# EAGLE design Smartwatch-EXTRA-BOTTOM (EAGLE 9.6.2)
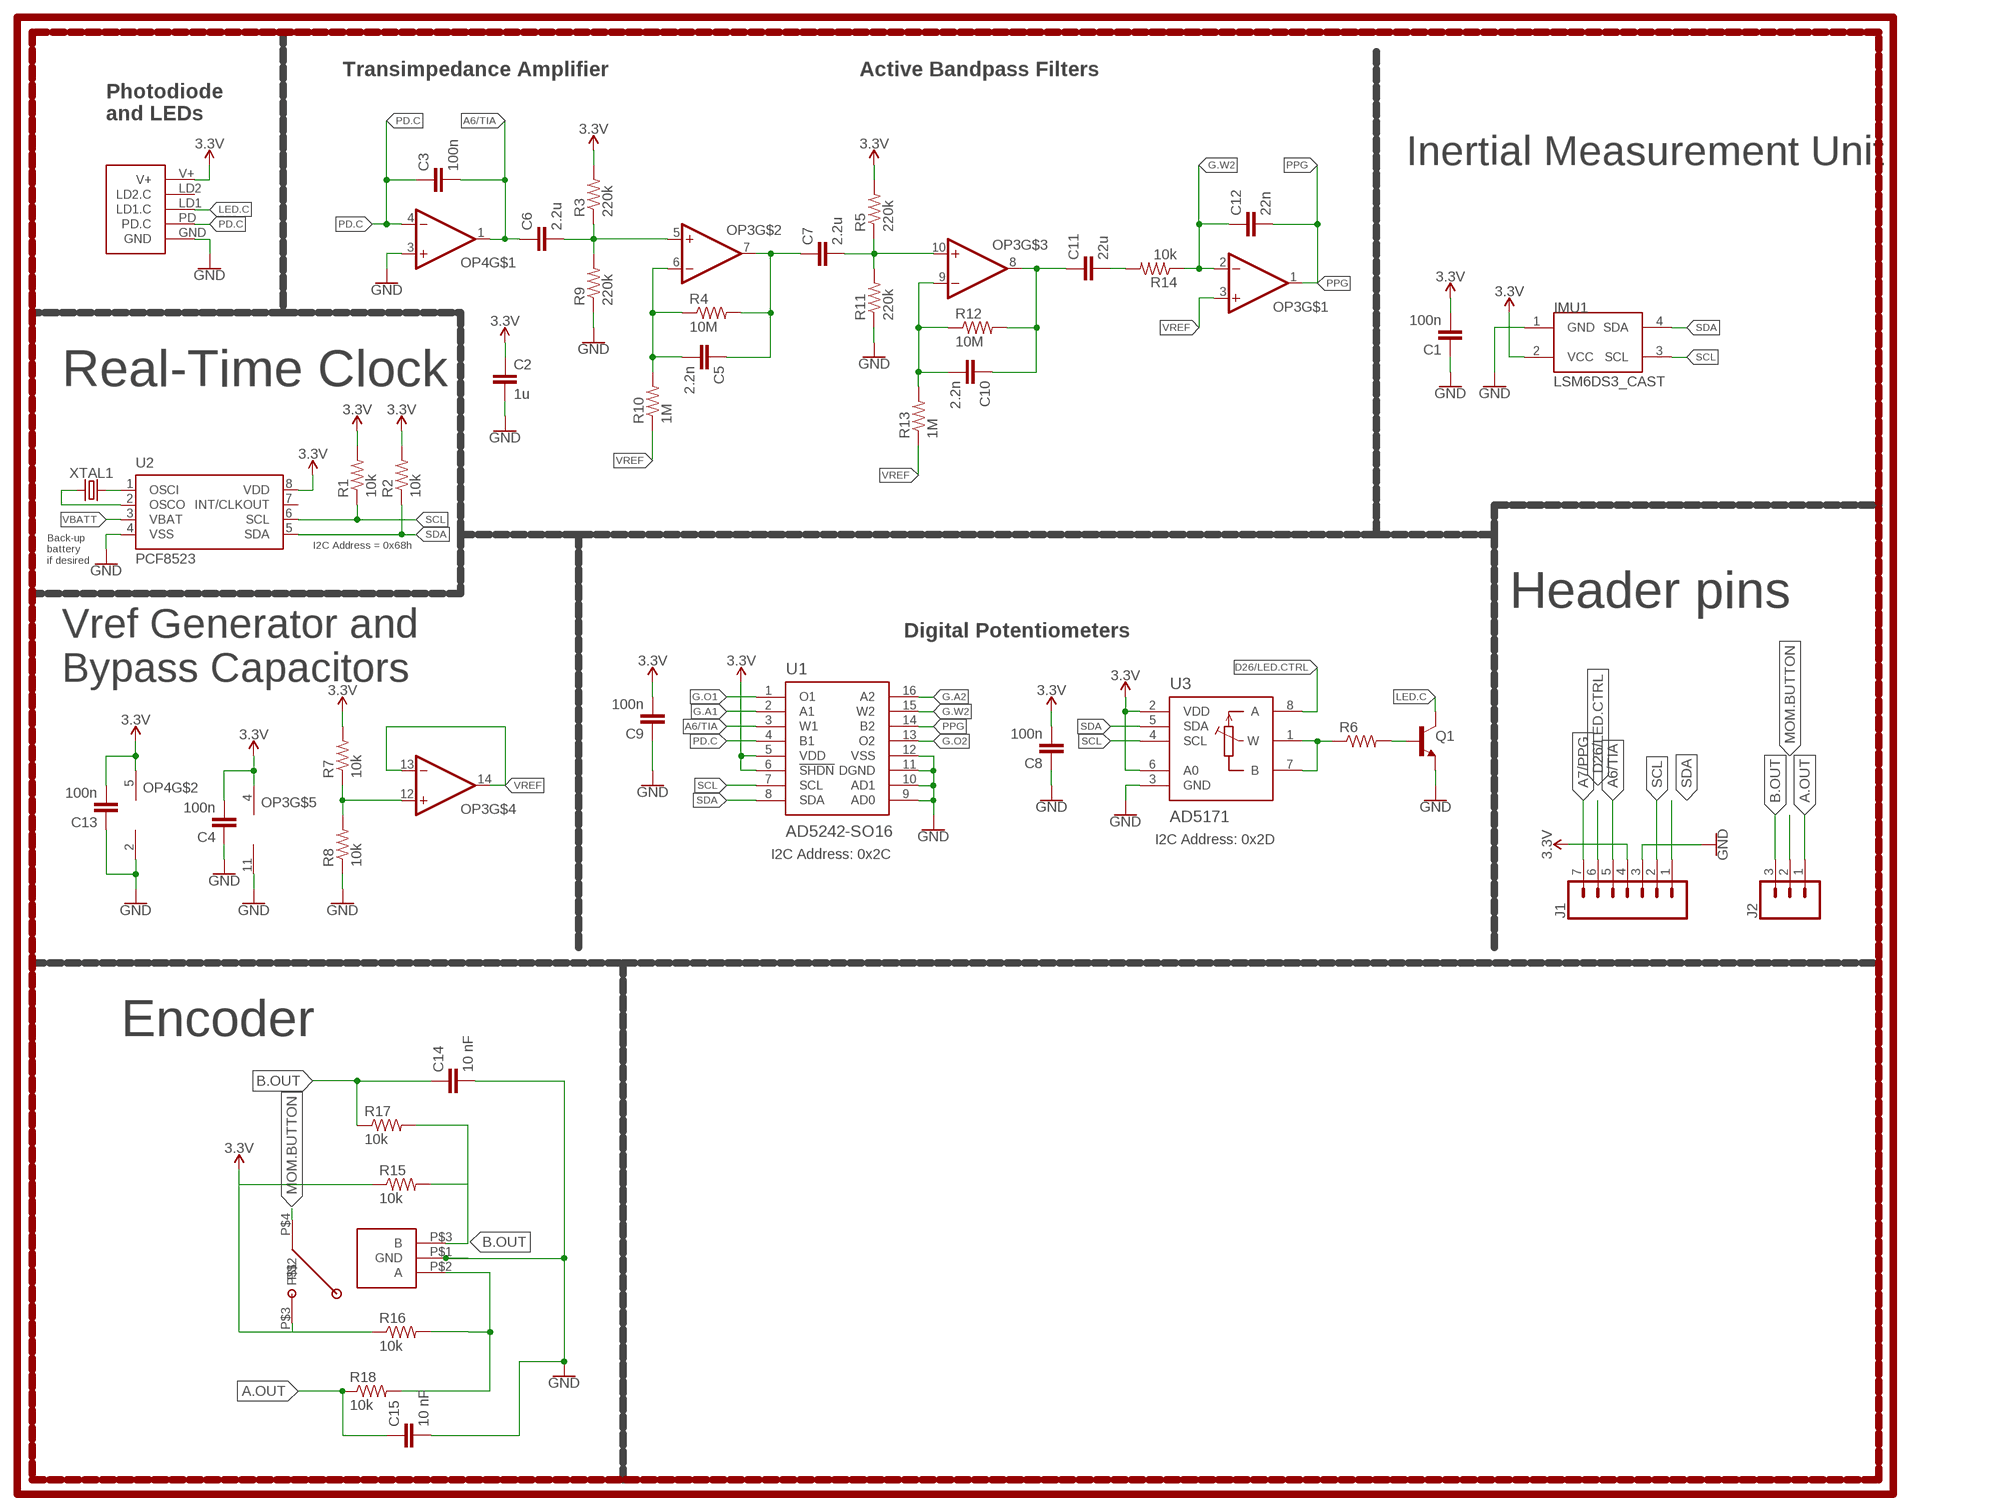
[diagram p0: schematic, sheet 1]

## Parts
B1  SWITCH  [SWITCH]
C1  100n  CAPACITOR0603  [C0603]
C2  1u  CAPACITOR0603  [C0603]
C3  100n  CAPACITOR0603  [C0603]
C4  100n  CAPACITOR0603  [C0603]
C5  2.2n  CAPACITOR0603  [C0603]
C6  2.2u  CAPACITOR0603  [C0603]
C7  2.2u  CAPACITOR0603  [C0603]
C8  100n  CAPACITOR0603  [C0603]
C9  100n  CAPACITOR0603  [C0603]
C10  2.2n  CAPACITOR0603  [C0603]
C11  22u  CAPACITOR0603  [C0603]
C12  22n  CAPACITOR0603  [C0603]
C13  100n  CAPACITOR0603  [C0603]
C14  10 nF  CAPACITOR0603  [C0603]
C15  10 nF  CAPACITOR0603  [C0603]
ENC1  EVQVU  [EVQVU]
IMU1  LSM6DS3_CAST  [LSM6DS3_CAST]
J1  CONN_07-1.27MM  [1X07_1.27MM]
J2  CONN_03.50MIL  [1X03_1.27MM]
OP3  OP-QUAD-SO14  [SO14]
OP4  OP-SINGLEOT  [SOT23-5]
Q1  NPN-GENERIC  [SOT23-3]
R1  10k  RESISTOR0603  [R0603]
R2  10k  RESISTOR0603  [R0603]
R3  220k  RESISTOR0603  [R0603]
R4  10M  RESISTOR0603  [R0603]
R5  220k  RESISTOR0603  [R0603]
R6  RESISTOR0603  [R0603]
R7  10k  RESISTOR0402  [R0402]
R8  10k  RESISTOR0402  [R0402]
R9  220k  RESISTOR0603  [R0603]
R10  1M  RESISTOR0603  [R0603]
R11  220k  RESISTOR0603  [R0603]
R12  10M  RESISTOR0603  [R0603]
R13  1M  RESISTOR0603  [R0603]
R14  10k  RESISTOR0603  [R0603]
R15  10k  RESISTOR0603  [R0603]
R16  10k  RESISTOR0603  [R0603]
R17  10k  RESISTOR0603  [R0603]
R18  10k  RESISTOR0603  [R0603]
U1  AD5242-SO16  [SO16]
U2  PCF8523  [SO8]
U3  AD5171  [SOT-23-8]
U4  PPG.MODULE.2  [PPG.MODULE.2]
XTAL1  32.7680kHz  CRYSTALECS-.327-12.5-12-C-TR  [2-SMD.NOLEAD.2.0MMTO1.2MM]

## Nets
3.3V: B1.P$3 C1.2 C2.1 C4.2 C8.2 C9.2 C13.2 IMU1.2(VCC) J1.4 OP3.4(V+) OP4.5(V+) R1.2 R2.2 R3.2 R5.2 R7.2 R15.1 R16.1 U1.5(VDD) U1.6(!SHDN) U2.8(VDD) U3.2(VDD) U3.6(A0) U4.V+
A6/TIA: C3.2 C6.1 J1.5 OP4.1(OUT) U1.3(W1)
A7/PPG: J1.7
A.OUT: C15.1 ENC1.P$2(A) J2.1 R16.2 R18.1 R18.2
B.OUT: C14.1 ENC1.P$3(B) J2.3 R17.1
D26/LED.CTRL: J1.6 U3.8(A)
G.A1: U1.2(A1)
G.A2: U1.16(A2)
G.O1: U1.1(O1)
G.O2: U1.13(O2)
G.W2: C12.1 OP3.2(-IN) R14.1 U1.15(W2)
GND: C1.1 C2.2 C4.1 C8.1 C9.1 C13.1 C14.2 C15.2 ENC1.P$1(GND) IMU1.1(GND) J1.3 OP3.11(V-) OP4.2(V-) OP4.3(+IN) Q1.2(E) R8.1 R9.1 R11.1 U1.9(AD0) U1.10(AD1) U1.11(DGND) U1.12(VSS) U2.4(VSS) U3.3(GND) U4.GND
LED.C: Q1.3(C) U4.LD1(LD1.C)
MOM.BUTTON: B1.P$4 J2.2
N$2: U2.2(OSCO) XTAL1.P$1
N$3: U2.1(OSCI) XTAL1.P$2
N$4: R15.2 R17.2
N$8: Q1.1(B) R6.2
N$9: R6.1 U3.1(W) U3.7(B)
N$10: OP3.12(+IN) R7.1 R8.2
N$13: C6.2 OP3.5(+IN) R3.1 R9.2
N$15: C5.2 OP3.6(-IN) R4.1 R10.2
N$16: C5.1 C7.1 OP3.7(OUT) R4.2
N$17: C7.2 OP3.10(+IN) R5.1 R11.2
N$18: C10.2 OP3.9(-IN) R12.1 R13.2
N$19: C10.1 C11.1 OP3.8(OUT) R12.2
N$20: C11.2 R14.2
PD.C: C3.1 OP4.4(-IN) U1.4(B1) U4.PD(PD.C)
PPG: C12.2 OP3.1(OUT) U1.14(B2)
SCL: IMU1.3(SCL) J1.2 R1.1 U1.7(SCL) U2.6(SCL) U3.4(SCL)
SDA: IMU1.4(SDA) J1.1 R2.1 U1.8(SDA) U2.5(SDA) U3.5(SDA)
VBATT: U2.3(VBAT)
VREF: OP3.3(+IN) OP3.13(-IN) OP3.14(OUT) R10.1 R13.1
Unconnected: U2.7(INT/CLKOUT) U4.LD2(LD2.C)

## Notes on the sheet
- Transimpedance Amplifier | Active Bandpass Filters
- Photodiode
  and LEDs
- Inertial Measurement Unit
- Real-Time Clock
- I2C Address = 0x68h
- Back-up
  battery
  if desired
- Header pins
- Digital Potentiometers
- Vref Generator and
  Bypass Capacitors
- I2C Address: 0x2D
- I2C Address: 0x2C
- Encoder

## Library data of the parts
B1 = Encoder:SWITCH
C1-C15 = LinnesLab-Passives:CAPACITOR
ENC1 = Encoder:EVQVU
IMU1 = LinnesLab-Sensors:LSM6DS3_CAST
J1 = LinnesLab-Connectors:CONN_07: Multi connection point. Often used as Generic Header-pin footprint for 0.1 inch spaced/style header connections On any of the 0.1 inch spaced packages, you can populate with these: Break Away Headers - Straight <https://www.sparkfun.com/products/116> (PRT-00116) Break Away Male Headers - Right Angle <https://www.sparkfun.com/products/553> (PRT-00553) Female Headers <https://www.sparkfun.com/products/115> (PRT-00115) Break Away Headers - Machine Pin <https://www.sparkfun.com/products/117> (PRT-00117) Break Away Female Headers - Swiss Machine Pin <https://www.sparkfun.com/products/743> (PRT-00743) For SCREWTERMINALS and SPRING TERMINALS visit here: Screw Terimnals on SparkFun.com <https://www.sparkfun.com/search/results?term=Screw+Terminals> (5mm/3.5mm/2.54mm spacing) This device is also useful as a general connection point to wire up your design to another part of your project. Our various solder wires solder well into these plated through hole pads. Hook-Up Wire - Assortment (Stranded, 22 AWG) <https://www.sparkfun.com/products/11375> (PRT-11375) Hook-Up Wire - Assortment (Solid Core, 22 AWG) <https://www.sparkfun.com/products/11367> (PRT-11367) View the entire wire category on our website here <https://www.sparkfun.com/categories/141> Special notes: Molex polarized connector foot print use with SKU : PRT-08231 with associated crimp pins and housings. 1MM SMD Version SKU: PRT-10208 NOTES ON THE VARIANTS LOCK and LOCK_LONGPADS... This footprint was designed to help hold the alignment of a through-hole component (i.e. 6-pin header) while soldering it into place. You may notice that each hole has been shifted either up or down by 0.005 of an inch from it's more standard position (which is a perfectly straight line). This slight alteration caused the pins (the squares in the middle) to touch the edges of the holes. Because they are alternating, it causes a "brace" to hold the component in place. 0.005 has proven to be the perfect amount of "off-center" position when using our standard breakaway headers. Although looks a little odd when you look at the bare footprint, once you have a header in there, the alteration is very hard to notice. Also,if you push a header all the way into place, it is covered up entirely on the bottom side.
J2 = LinnesLab-Connectors:CONN_03: Multi connection point. Often used as Generic Header-pin footprint for 0.1 inch spaced/style header connections On any of the 0.1 inch spaced packages, you can populate with these: Break Away Headers - Straight <https://www.sparkfun.com/products/116> (PRT-00116) Break Away Male Headers - Right Angle <https://www.sparkfun.com/products/553> (PRT-00553) Female Headers <https://www.sparkfun.com/products/115> (PRT-00115) Break Away Headers - Machine Pin <https://www.sparkfun.com/products/117> (PRT-00117) Break Away Female Headers - Swiss Machine Pin <https://www.sparkfun.com/products/743> (PRT-00743) Stackable Header - 3 Pin (Female, 0.1") <https://www.sparkfun.com/products/13875> (PRT-13875) For SCREWTERMINALS and SPRING TERMINALS visit here: Screw Terimnals on SparkFun.com <https://www.sparkfun.com/search/results?term=Screw+Terminals> (5mm/3.5mm/2.54mm spacing) This device is also useful as a general connection point to wire up your design to another part of your project. Our various solder wires solder well into these plated through hole pads. Hook-Up Wire - Assortment (Stranded, 22 AWG) <https://www.sparkfun.com/products/11375> (PRT-11375) Hook-Up Wire - Assortment (Solid Core, 22 AWG) <https://www.sparkfun.com/products/11367> (PRT-11367) View the entire wire category on our website here <https://www.sparkfun.com/categories/141> Special notes: Molex polarized connector foot print use with SKU : PRT-08232 with associated crimp pins and housings.
OP3 = LinnesLab-AnalogIC:OP-QUAD: General symbol and footprints for Quad Op Amps. Use with any standard general purpose op amp.
OP4 = LinnesLab-AnalogIC:OP-SINGLE: Single Op Amp 2.7V to 6.0V Single Supply CMOS Source: http://ww1.microchip.com/downloads/en/DeviceDoc/21314g.pdf
Q1 = LinnesLab-DiscreteSemi:NPN
R1-R18 = LinnesLab-Passives:RESISTOR
U1 = LinnesLab-DigitalIC:AD5242
U2 = LinnesLab-Clocks:PCF8523; DIGIKEY: 568-5306-1-ND; I2C_ADDRESS: 0x68h; MFN: PCF8523T/1,118; MFN_MANUFACTURER: NXP USA Inc.
U3 = LinnesLab-DigitalIC:AD5171
U4 = LinnesLab-Connectors:PPG.MODULE.2: Digi-Key Part Number: S9014E-50-ND Manufacturer Part Number: GRPB501VWVN-RC Description: 1mm insulation height 0.05in pitch 50 positions
XTAL1 = LinnesLab-Clocks:CRYSTAL; DIGIKEY: XC2288CT-ND; FREQ: 32.7680KHZ; LOAD_CAP: 12.5pF

## Board
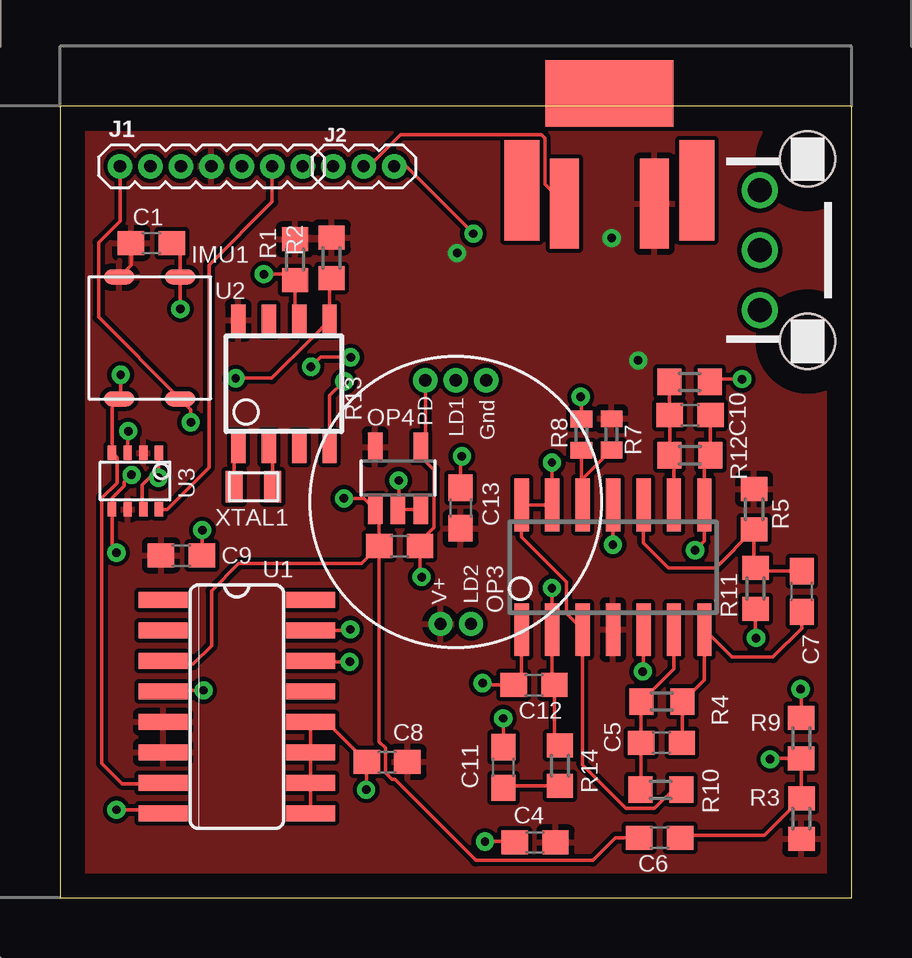
[diagram p1: board, top side]
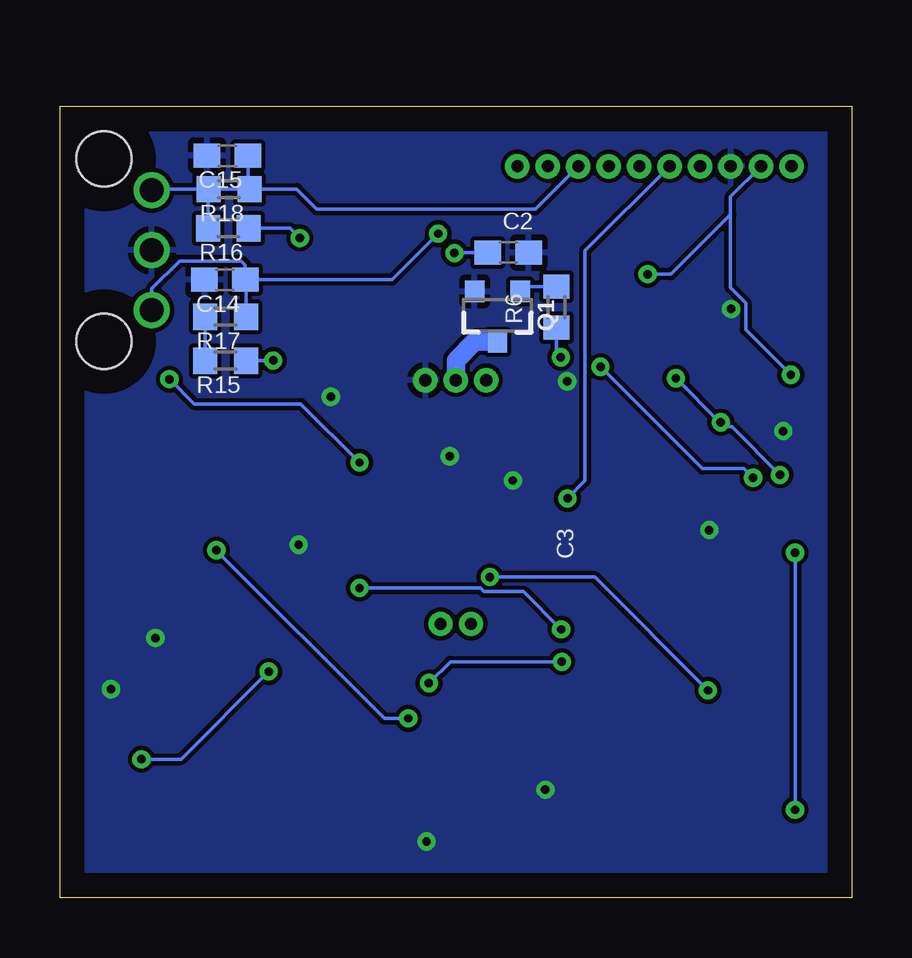
[diagram p2: board, bottom side, seen from below]

Size 33 x 33 mm. Coordinates in mm from the lower left corner, seen from the top.
Outline: 0,0 33,0 33,33 0,33 0,0
Copper layers (1*16): Top 0.035mm / dielectric 1.5mm / Bottom 0.035mm
Design rules "default": minimum track width 6mil, minimum drill 0.35mm, track to track 6mil, track to pad 6mil, pad to pad 6mil, via to via 6mil, smd to smd 6mil, copper to edge 40mil, drill to drill 6mil, minimum pad ring 10mil, minimum via ring 8mil, stop-mask expansion 4mil, vias tented up to drill 0mil, thermal gap 10mil

### Footprints (pad centres in the part's own frame; a part is rotated, then mirrored left to right if it is on the bottom)
SWITCH = smd 5.33 x 2.79: P$1 0,-1.395 | smd 1.46 x 4.19: P$2 3.65,-5.445; P$5 -3.65,-5.445 | smd 1.205 x 3.76: P$3 1.873,-5.99; P$4 -1.873,-5.99
C0603 = smd 1.1 x 1: 1 -0.85,0; 2 0.85,0
EVQVU = drill 1: P$1 0,0; P$2 2.5,0; P$3 -2.5,0 | hole 2.3: 3.8,-2; -3.8,-2
LSM6DS3_CAST = smd 0.635 x 1.27: 1 -2.54,1.27; 2 -2.54,-1.27; 3 2.54,-1.27; 4 2.54,1.27
1X07_1.27MM = drill 0.508 pad 1: 1 0,0; 2 1.27,0; 3 2.54,0; 4 3.81,0; 5 5.08,0; 6 6.35,0; 7 7.62,0
1X03_1.27MM = drill 0.508 pad 1: 1 0,0; 2 1.27,0; 3 2.54,0
SO14 = smd 0.6 x 2.2: 1 -3.81,-2.6; 2 -2.54,-2.6; 3 -1.27,-2.6; 4 0,-2.6; 5 1.27,-2.6; 6 2.54,-2.6; 7 3.81,-2.6; 8 3.81,2.6; 9 2.54,2.6; 10 1.27,2.6; 11 0,2.6; 12 -1.27,2.6; 13 -2.54,2.6; 14 -3.81,2.6
SOT23-5 = smd 0.6 x 1.2: 1 -0.95,-1.306; 2 0,-1.306; 3 0.95,-1.306; 4 0.95,1.306; 5 -0.95,1.306
SOT23-3 = smd 0.8 x 0.9: 1 -0.95,-1; 2 0.95,-1; 3 0,1.1
R0603 = smd 1 x 1.1: 1 -0.85,0; 2 0.85,0
R0402 = smd 0.7 x 0.9: 1 -0.65,0; 2 0.65,0
SO16 = smd 0.66 x 2.032: 1 -4.445,-3.073; 2 -3.175,-3.073; 3 -1.905,-3.073; 4 -0.635,-3.073; 5 0.635,-3.073; 6 1.905,-3.073; 7 3.175,-3.073; 8 4.445,-3.073; 9 4.445,3.073; 10 3.175,3.073; 11 1.905,3.073; 12 0.635,3.073; 13 -0.635,3.073; 14 -1.905,3.073; 15 -3.175,3.073; 16 -4.445,3.073
SO8 = smd 1.3 x 0.6: 1 -2.65,1.905; 2 -2.65,0.635; 3 -2.65,-0.635; 4 -2.65,-1.905; 5 2.65,-1.905; 6 2.65,-0.635; 7 2.65,0.635; 8 2.65,1.905
SOT-23-8 = smd 0.35 x 0.6: 1 -0.991,-1.176; 2 -0.341,-1.176; 3 0.309,-1.176; 4 0.959,-1.176; 5 0.959,1.176; 6 0.309,1.176; 7 -0.341,1.176; 8 -0.991,1.176
PPG.MODULE.2 = drill 0.508 pad 0.94: GND 1.27,5.08; LD1 0,5.08; LD2 0.635,-5.08; PD -1.27,5.08; V+ -0.635,-5.08
2-SMD.NOLEAD.2.0MMTO1.2MM = smd 0.7 x 1.3: P$1 -0.8,0; P$2 0.8,0

### Placement (x,y rotation side)
B1  22.91,34.93 0 top
C1  3.81,27.3 180 top
C2  14.31,26.9 0 bottom
C3  14.16,14.66 180 top
C4  19.81,2.31 0 top
C5  25.07,6.47 180 top
C6  25,2.51 0 top
C7  30.92,12.77 90 top
C8  13.63,5.66 0 top
C9  5.06,14.28 180 top
C10  26.27,20.12 180 top
C11  18.48,5.44 270 top
C12  19.76,8.88 180 top
C13  16.71,16.25 270 top
C14  26.12,25.77 180 bottom
C15  26.02,30.95 180 bottom
ENC1  29.17,27 90 top
IMU1  3.74,23.34 270 top
J1  2.5,30.5 0 top
J2  11.39,30.5 0 top
OP3  23.06,13.79 0 top
OP4  14.09,17.5 0 top
Q1  14.76,24.29 180 bottom
R1  9.8,26.61 90 top
R2  11.32,26.68 90 top
R3  30.91,3.31 270 top
R4  25.09,8.19 0 top
R5  28.94,16.2 90 top
R6  12.3,24.63 90 bottom
R7  22.99,19.32 90 top
R8  21.74,19.31 270 top
R9  30.9,6.66 270 top
R10  25.05,4.51 180 top
R11  29,12.9 90 top
R12  26.27,18.45 0 top
R13  26.25,21.51 180 top
R14  20.84,5.51 270 top
R15  26.1,22.39 180 bottom
R16  25.98,27.92 180 bottom
R17  26.09,24.23 180 bottom
R18  25.95,29.55 180 bottom
U1  7.37,7.97 270 top
U2  9.34,21.43 90 top
U3  3.13,17.38 180 top
U4  16.5,16.5 0 top
XTAL1  8.07,17.14 180 top

### Tracks (layer width: path | path; a pad name or v marks a point on that pad's centre or on a via)
3.3V  (via drill 0.35)
  Top 0.152: C1.2 2.96,26.37 IMU1.2
  Bottom 0.152: R16.1 23.41,27.92 v23,27.51 | v16.55,26.88 16.54,26.9 C2.1 | R15.1 v24.12,22.39 v24.11,22.41
  pour Top (isolate 0.178): 0.57,32.2 32.55,32.2 32.55,0.19 0.57,0.19
A6/TIA  (via drill 0.35)
  Top 0.152: C6.1 23.16,2.51 22.21,1.56 17.34,1.56 13.97,4.93 13.84,4.93 13.56,5.21 13.56,6.26 13.31,6.51 C3.2 | C3.2 13.31,16.02 OP4.1 12.68,16.65 v11.84,16.65 | C3.2 12.58,13.93 7.46,13.93 6.31,12.79 6.31,10.5 5.56,9.75 4.43,9.75 U1.3
  Bottom 0.152: J1.5 11.1,26.98 11.1,17.39 v11.84,16.65
A.OUT
  Bottom 0.152: C15.1 25.16,30.94 25.16,29.88 25.1,29.94 R18.1 | J2.1 13.18,28.71 22.3,28.71 23.13,29.55 R18.1 | R18.2 26.83,29.55 R16.2 | R18.2 29.13,29.55 ENC1.P$2 | R18.1 R18.2
B.OUT  (via drill 0.35)
  Top 0.152: v17.23,27.69 14.43,30.5 J2.3
  Bottom 0.152: ENC1.P$3 29.17,25.4 28.02,26.55 25.44,26.55 25.27,26.39 C14.1 | v17.23,27.69 19.16,25.77 C14.1 | R17.1 25.24,25.73 C14.1
D26/LED.CTRL
  Top 0.152: U3.8 4.47,16.2 6.21,17.95 6.21,26.38 8.85,29.02 J1.6
G.W2  (via drill 0.35)
  Top 0.152: R14.1 20.61,6.59 C12.1 20.52,8.98 OP3.2 v20.52,12.91 v20.51,12.92 | v12.11,11.19 12.06,11.15 U1.15
  Bottom 0.152: v20.51,12.92 15.48,12.92 15.33,12.77 13.68,12.77 v12.11,11.19
GND  (via drill 0.35)
  Top 0.152: R11.1 29,10.86 v29.02,10.84 | R9.1 30.9,8.68 v30.88,8.7 | C4.1 18.91,2.35 v17.72,2.35 | OP3.11 v23.05,14.72 | v11.85,21.54 11.24,20.95 U2.4 | v5.02,24.55 v5.01,24.56 IMU1.1 5.01,26.95 C1.1 | v12.77,4.51 12.79,4.53 C8.1 11.11,7.34 10.48,7.34 | U1.12 10.48,7.34 | v14.12,17.4 14.14,17.4 14.14,16.24 OP4.2 OP4.3 | R8.1 21.74,20.86 v21.71,20.89 | U3.3 2.82,19.44 v2.85,19.46 | U1.9 U1.10 U1.11 10.45,7.3 10.48,7.34 | C9.1 5.93,14.3 v5.93,15.33 | C13.1 16.71,18.36 v16.75,18.41
  pour Bottom (isolate 0.178): 0.5,32.02 32.04,32.02 32.04,1.06 0.5,1.06
LED.C
  Bottom 0.762: U4.LD1 16.49,21.59 16.49,22.41 15.71,23.19 Q1.3
MOM.BUTTON
  Top 0.152: B1.P$4 20.22,29.76 20.22,31.68 20.08,31.81 14.2,31.81 12.89,30.5 J2.2
N$2
  Top 0.152: XTAL1.P$1 8.87,18.62 U2.2
N$3
  Top 0.152: XTAL1.P$2 7.27,18.62 U2.1
N$4
  Bottom 0.152: R15.2 R17.2
N$8
  Bottom 0.152: R6.2 13.62,25.48 Q1.1
N$9  (via drill 0.35)
  Top 0.152: U3.1 4.12,17.54 v4.1,17.52 3.72,17.52 3.42,17.21 3.42,16.25 U3.7 | v12.12,22.54 10.86,22.54 v10.46,22.14
  Bottom 0.152: v4.1,17.52 4.49,17.9 6.22,17.9 v10.46,22.14 | R6.1 12.3,22.72 v12.12,22.54
N$10
  Top 0.152: R8.2 21.74,16.43 OP3.12 21.79,17.47 R7.1
N$13  (via drill 0.35)
  Top 0.152: C6.2 25.95,2.61 29.36,2.61 R3.1 30.91,5.8 R9.2 29.63,5.81 v29.61,5.78 | v24.3,9.44 24.32,9.47 OP3.5
  Bottom 0.152: v29.61,5.78 27.95,5.78 v24.3,9.44
N$15
  Top 0.152: OP3.6 25.59,9.54 R4.1 24.23,8.17 C5.2 24.23,4.54 R10.2
N$16
  Top 0.152: R4.2 25.94,8.17 | 25.94,8.17 25.94,6.49 C5.1 | C7.1 30.92,11.23 29.73,10.04 28.01,10.04 OP3.7 26.86,9.09 25.94,8.17
N$17
  Top 0.152: C7.2 29.13,13.62 R11.2 28.94,13.82 R5.1 27.34,13.76 25.36,13.76 24.32,14.8 OP3.10
N$18
  Top 0.152: R13.2 25.4,20.14 C10.2 R12.1 25.59,18.27 OP3.9
N$19  (via drill 0.35)
  Top 0.152: C11.1 v18.48,7.48 | v26.48,14.49 26.86,14.88 OP3.8 26.86,18.2 R12.2 C10.1
  Bottom 0.152: v26.48,14.49 19.47,7.48 v18.48,7.48
N$20
  Top 0.152: R14.2 18.56,4.66 C11.2
PD.C  (via drill 0.35)
  Top 0.152: U4.PD 15.23,19 OP4.4 15.04,18.41 15.6,17.84 15.6,15.44 15.01,14.85 C3.1 15.01,13.44 v15.08,13.38 | U1.4 4.34,8.65 v5.98,8.65
  Bottom 0.152: v5.98,8.65 10.71,13.38 v15.08,13.38
PPG  (via drill 0.35)
  Top 0.152: OP3.1 19.25,9.21 C12.2 17.69,8.88 v17.62,8.96 | v12.08,9.84 10.48,9.84 U1.14
  Bottom 0.152: v12.08,9.84 16.73,9.84 v17.62,8.96
SCL  (via drill 0.35)
  Top 0.152: U2.6 9.8,24.25 R1.1 9.72,25.76 9.48,26 v8.5,26 | v2.53,21.81 2.53,20.86 IMU1.3 2.17,20.51 U3.4 2.38,18.35 2.38,17.3 1.75,16.67 1.75,5.62 2.6,4.76 4.27,4.76 U1.7
  Bottom 0.152: v2.53,21.81 4.41,23.69 4.41,24.8 5.04,25.43 5.04,28.49 | 5.04,28.49 7.53,26 v8.5,26 | 5.04,28.49 5.04,29.23 J1.2
SDA  (via drill 0.35)
  Top 0.152: R2.1 11.24,25.75 U2.5 10.5,23.34 8.82,21.66 v7.32,21.66 | U1.8 4.14,3.67 v2.35,3.67 | J1.1 2.5,28.21 1.61,27.32 1.61,24.21 IMU1.4 5.45,20.37 v5.45,19.83 | v2.35,14.39 2.17,14.57 U3.5 2.17,16.67 2.68,17.18 2.68,17.33 v2.98,17.63
  Bottom 0.152: v2.35,14.39 v2.35,3.67 | v2.98,17.63 5,19.65 5.27,19.65 v5.45,19.83 5.49,19.83 v7.32,21.66
VREF  (via drill 0.35)
  Top 0.152: R10.1 25.57,4.51 24.79,3.73 23.6,3.73 21.79,5.55 OP3.3 21.12,11.85 21.12,13.17 19.25,15.04 OP3.14 OP3.13 v20.52,18.15 v20.51,18.15 | v28.44,21.62 27.22,21.62 R13.1
  Bottom 0.152: v20.51,18.15 22.96,20.6 27.41,20.6 v28.44,21.62